# Altium schematic sheet SPE_PHY.SchDoc
size A4; SheetNumber: 4; SheetTotal: 5
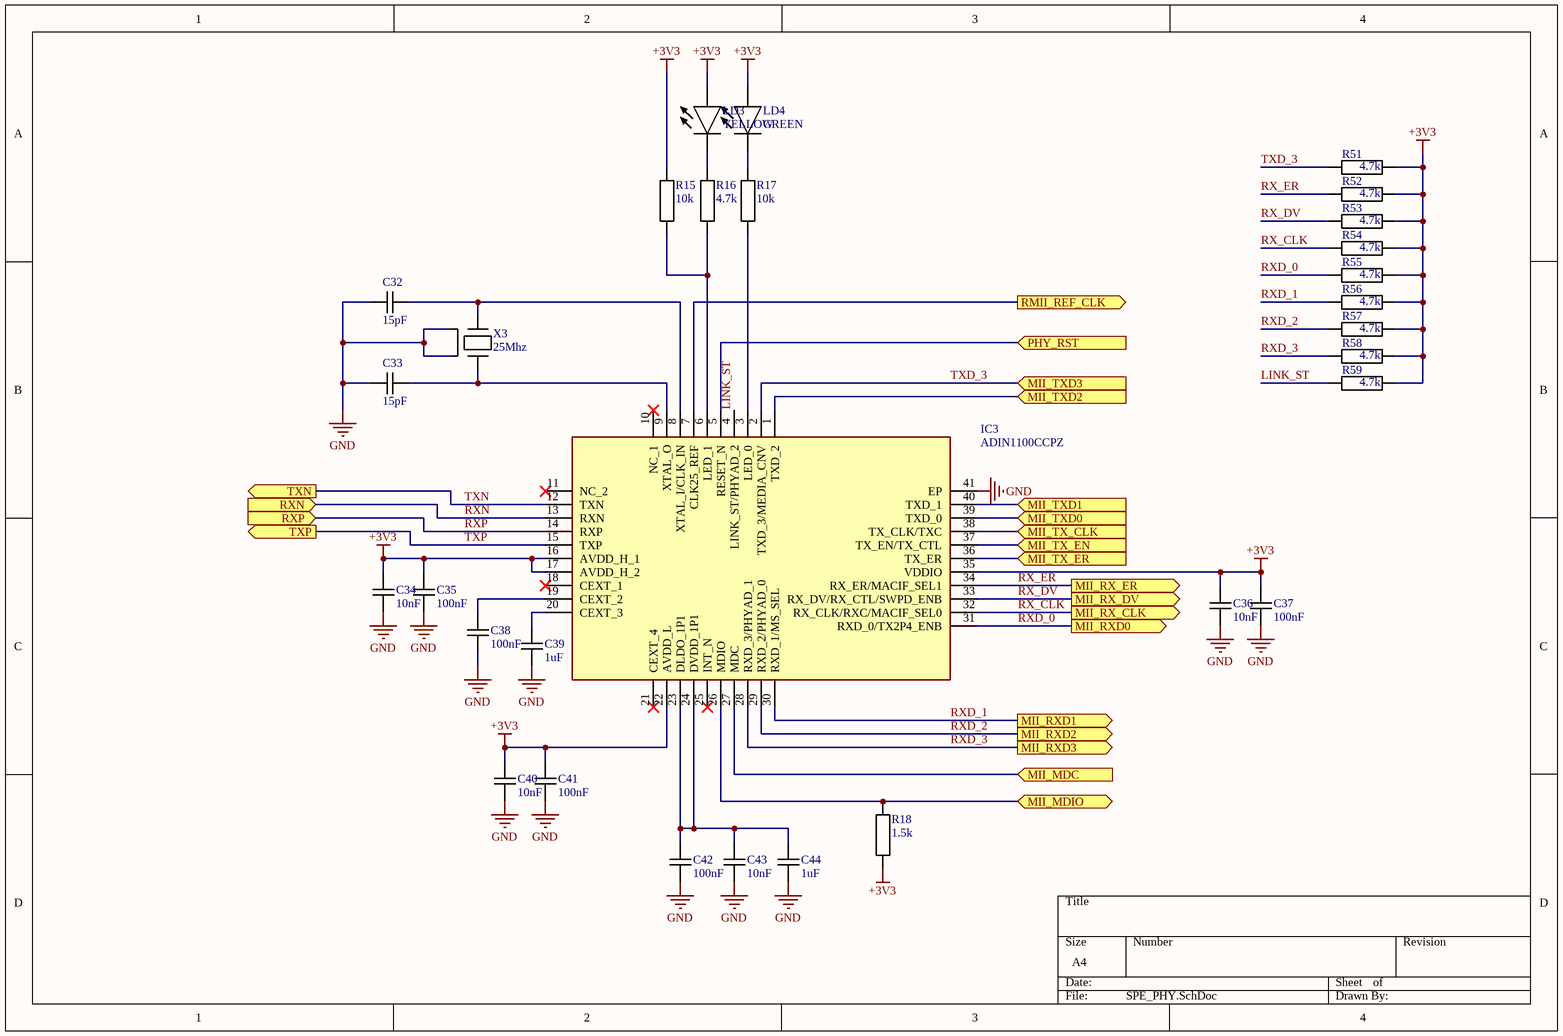
[diagram p0: SPE_PHY.SchDoc]

## Parts
C32  15pF  [CAPACITOR 1608 REFLOW]
C33  15pF  [CAPACITOR 1608 REFLOW]
C34  10nF  [CAPACITOR 1608 REFLOW]
C35  100nF  [CAPACITOR 1608 REFLOW]
C36  10nF  [CAPACITOR 1608 REFLOW]
C37  100nF  [CAPACITOR 1608 REFLOW]
C38  100nF  [CAPACITOR 1608 REFLOW]
C39  1uF  [CAPACITOR 1608 REFLOW]
C40  10nF  [CAPACITOR 1608 REFLOW]
C41  100nF  [CAPACITOR 1608 REFLOW]
C42  100nF  [CAPACITOR 1608 REFLOW]
C43  10nF  [CAPACITOR 1608 REFLOW]
C44  1uF  [CAPACITOR 1608 REFLOW]
IC3  ADIN1100CCPZ  [QFN50P600X600X80-41N-D]
LD3  YELLOW  [LED 1608 REFLOW]
LD4  GREEN  [LED 1608 REFLOW]
R15  10k  [RESISTOR 1608 REFLOW]
R16  4.7k  [RESISTOR 1608 REFLOW]
R17  10k  [RESISTOR 1608 REFLOW]
R18  1.5k  [RESISTOR 1608 REFLOW]
R51  4.7k  [RESISTOR 1608 REFLOW]
R52  4.7k  [RESISTOR 1608 REFLOW]
R53  4.7k  [RESISTOR 1608 REFLOW]
R54  4.7k  [RESISTOR 1608 REFLOW]
R55  4.7k  [RESISTOR 1608 REFLOW]
R56  4.7k  [RESISTOR 1608 REFLOW]
R57  4.7k  [RESISTOR 1608 REFLOW]
R58  4.7k  [RESISTOR 1608 REFLOW]
R59  4.7k  [RESISTOR 1608 REFLOW]
X3  25Mhz  [Crystal C2.5x2 Seiko Epson FA-128]

## Ports
MII_MDC (in), MII_MDIO (bidir), MII_RX_CLK (out), MII_RX_DV (out), MII_RX_ER (out), MII_RXD0 (out), MII_RXD1 (out), MII_RXD2 (out), MII_RXD3 (out), MII_TX_CLK (in), MII_TX_EN (in), MII_TX_ER (in), MII_TXD0 (in), MII_TXD1 (in), MII_TXD2 (in), MII_TXD3 (in), PHY_RST (in), RMII_REF_CLK (out), RXN (in), RXP (in), TXN (out), TXP (out)

## Nets
+3V3: C34.2 C35.2 C36.2 C37.2 C40.2 C41.2 IC3.16(AVDD_H_1) IC3.17(AVDD_H_2) IC3.22(AVDD_L) IC3.35(VDDIO) LD3.2(A) LD4.2(A) R15.2 R18.1 R51.1 R52.1 R53.1 R54.1 R55.1 R56.1 R57.1 R58.1 R59.1
GND: C32.2 C33.2 C34.1 C35.1 C36.1 C37.1 C38.1 C39.1 C40.1 C41.1 C42.1 C43.1 C44.1 IC3.41(EP) X3.2 X3.4
LINK_ST: IC3.4(LINK_ST/PHYAD_2) R59.2
MII_MDC: IC3.27(MDC) ; port MII_MDC
MII_MDIO: IC3.26(MDIO) R18.2 ; port MII_MDIO
MII_TX_CLK: IC3.38(TX_CLK/TXC) ; port MII_TX_CLK
MII_TX_EN: IC3.37(TX_EN/TX_CTL) ; port MII_TX_EN
MII_TX_ER: IC3.36(TX_ER) ; port MII_TX_ER
MII_TXD0: IC3.39(TXD_0) ; port MII_TXD0
MII_TXD1: IC3.40(TXD_1) ; port MII_TXD1
MII_TXD2: IC3.1(TXD_2) ; port MII_TXD2
PHY_RST: IC3.5(RESET_N) ; port PHY_RST
RMII_REF_CLK: IC3.7(CLK25_REF) ; port RMII_REF_CLK
RX_CLK: IC3.32(RX_CLK/RXC/MACIF_SEL0) R54.2 ; port MII_RX_CLK
RX_DV: IC3.33(RX_DV/RX_CTL/SWPD_ENB) R53.2 ; port MII_RX_DV
RX_ER: IC3.34(RX_ER/MACIF_SEL1) R52.2 ; port MII_RX_ER
RXD_0: IC3.31(RXD_0/TX2P4_ENB) R55.2 ; port MII_RXD0
RXD_1: IC3.30(RXD_1/MS_SEL) R56.2 ; port MII_RXD1
RXD_2: IC3.29(RXD_2/PHYAD_0) R57.2 ; port MII_RXD2
RXD_3: IC3.28(RXD_3/PHYAD_1) R58.2 ; port MII_RXD3
RXN: IC3.13(RXN) ; port RXN
RXP: IC3.14(RXP) ; port RXP
TXD_3: IC3.2(TXD_3/MEDIA_CNV) R51.2 ; port MII_TXD3
TXN: IC3.12(TXN) ; port TXN
TXP: IC3.15(TXP) ; port TXP
NetC32_1: C32.1 IC3.8(XTAL_I/CLK_IN) X3.1
NetC33_1: C33.1 IC3.9(XTAL_O) X3.3
NetC38_2: C38.2 IC3.19(CEXT_2)
NetC39_2: C39.2 IC3.20(CEXT_3)
NetC42_2: C42.2 C43.2 C44.2 IC3.23(DLDO_1P1) IC3.24(DVDD_1P1)
NetIC3_3: IC3.3(LED_0) R17.1
NetIC3_6: IC3.6(LED_1) R15.1 R16.1
NetLD3_1: LD3.1(C) R16.2
NetLD4_1: LD4.1(C) R17.2

Not connected (* = marked no-connect by the designer): IC3 10(NC_1)* 11(NC_2)* 18(CEXT_1)* 21(CEXT_4)* 25(INT_N)*

## Library data of the parts
C32-C44 = Capacitor
  C32 C33: Value: 15pF
  C34 C36 C40 C43: Value: 10nF
  C35 C37 C38 C41 C42: Value: 100nF
  C39 C44: Value: 1uF
IC3 = ADIN1100CCPZ: Integrated Circuit; Manufacturer_Name: Analog Devices; Datasheet Link: https://www.analog.com/media/en/technical-documentation/data-sheets/adin1100.pdf; Height: 0.8mm; Manufacturer_Part_Number: ADIN1100CCPZ; Mouser Part Number: 584-ADIN1100CCPZ; Mouser Price/Stock: https://www.mouser.co.uk/ProductDetail/Analog-Devices/ADIN1100CCPZ?qs=pUKx8fyJudC406QBDc8dqQ%3D%3D; Arrow Part Number: ADIN1100CCPZ; Arrow Price/Stock: https://www.arrow.com/en/products/adin1100ccpz/analog-devices?region=nac
LD3 LD4 = LED: LED generic
  LD3: Value: YELLOW
  LD4: Value: GREEN
R15-R18 R51-R59 = Resistor
  R15 R17: Value: 10k
  R16 R51-R59: Value: 4.7k
  R18: Value: 1.5k
X3 = Crystal C2.5x2 Seiko Epson FA-128: Value: 25Mhz